# Altium schematic sheet Kameras.SchDoc: Kameras
size A4; Author: Schiechtl Alexander; SheetNumber: 2; SheetTotal: 6; Project: 3D_Scanner
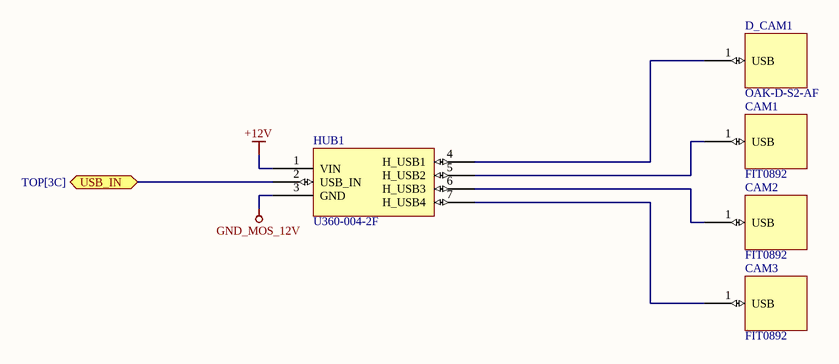
[diagram p0: Kameras.SchDoc]

## Parts
CAM1  FIT0892
CAM2  FIT0892
CAM3  FIT0892
D_CAM1  OAK-D-S2-AF
HUB1  U360-004-2F

## Ports
USB_IN (bidir, see TOP[3C])

## Nets
+12V: HUB1.1(VIN)
GND_MOS_12V: HUB1.3(GND)
USB_IN: HUB1.2(USB_IN) ; port USB_IN
NetCAM1_1: CAM1.1(USB) HUB1.5(H_USB2)
NetCAM2_1: CAM2.1(USB) HUB1.6(H_USB3)
NetCAM3_1: CAM3.1(USB) HUB1.7(H_USB4)
NetD_CAM1_1: D_CAM1.1(USB) HUB1.4(H_USB1)

## Notes on the sheet
- Project:
- Title:
- Leitner AG
- Zona Artigianale Est 7
- 39040 Racines BZ
- Italy
- Confidential
- Author:
- Document name:
- Date:
- Version:
- Size:
- A4

## Library data of the parts
CAM1-CAM3 = USB Kamera: Cameras & Camera Modules Megapixel 720p USB Wide-angle Camera for Raspberry Pi and NVIDIA Jetson Nano
D_CAM1 = Depth Kamera: Cameras & Camera Modules Robotic Perception Camera Series 2 with Auto Fcous, Stereo Depth, Object Tracking, Computer Vision, 4 TOPS of Processing Power for AI
HUB1 = USB HUB: Interface Modules 4PT USB3.0 SSSPD HUB/CHARGER